# Altium schematic sheet MCU.SchDoc
size A4; SheetNumber: 2; SheetTotal: 6
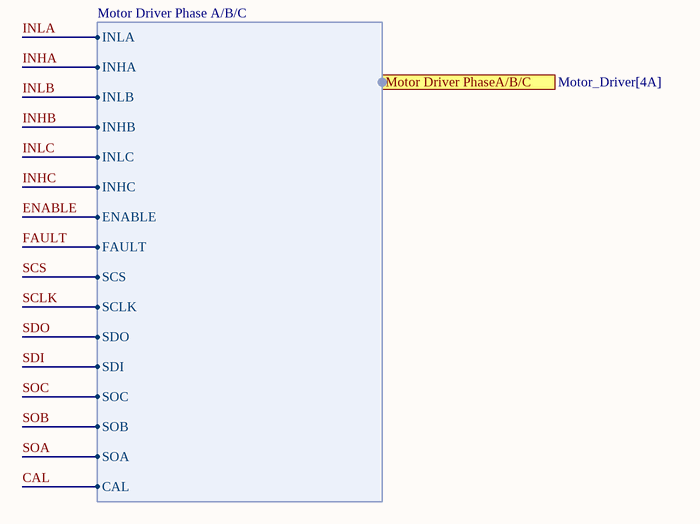
[diagram p0: MCU.SchDoc]

## Ports
Motor Driver PhaseA/B/C (harness Motor Driver Phase A/B/C, see Motor_Driver[4A])

## Harnesses
Motor Driver Phase A/B/C: INLA, INLC, INHB, INLB, INHA, INHC, ENABLE, FAULT, SCLK, SDO, SDI, SCS, SOC, SOB, SOA, CAL

## Nets
CAL: port Motor Driver PhaseA/B/C.CAL
ENABLE: port Motor Driver PhaseA/B/C.ENABLE
FAULT: port Motor Driver PhaseA/B/C.FAULT
INHA: port Motor Driver PhaseA/B/C.INHA
INHB: port Motor Driver PhaseA/B/C.INHB
INHC: port Motor Driver PhaseA/B/C.INHC
INLA: port Motor Driver PhaseA/B/C.INLA
INLB: port Motor Driver PhaseA/B/C.INLB
INLC: port Motor Driver PhaseA/B/C.INLC
SCLK: port Motor Driver PhaseA/B/C.SCLK
SCS: port Motor Driver PhaseA/B/C.SCS
SDI: port Motor Driver PhaseA/B/C.SDI
SDO: port Motor Driver PhaseA/B/C.SDO
SOA: port Motor Driver PhaseA/B/C.SOA
SOB: port Motor Driver PhaseA/B/C.SOB
SOC: port Motor Driver PhaseA/B/C.SOC